# EAGLE design Audio interface (EAGLE 9.6.0)

## Sheet 1 of 2
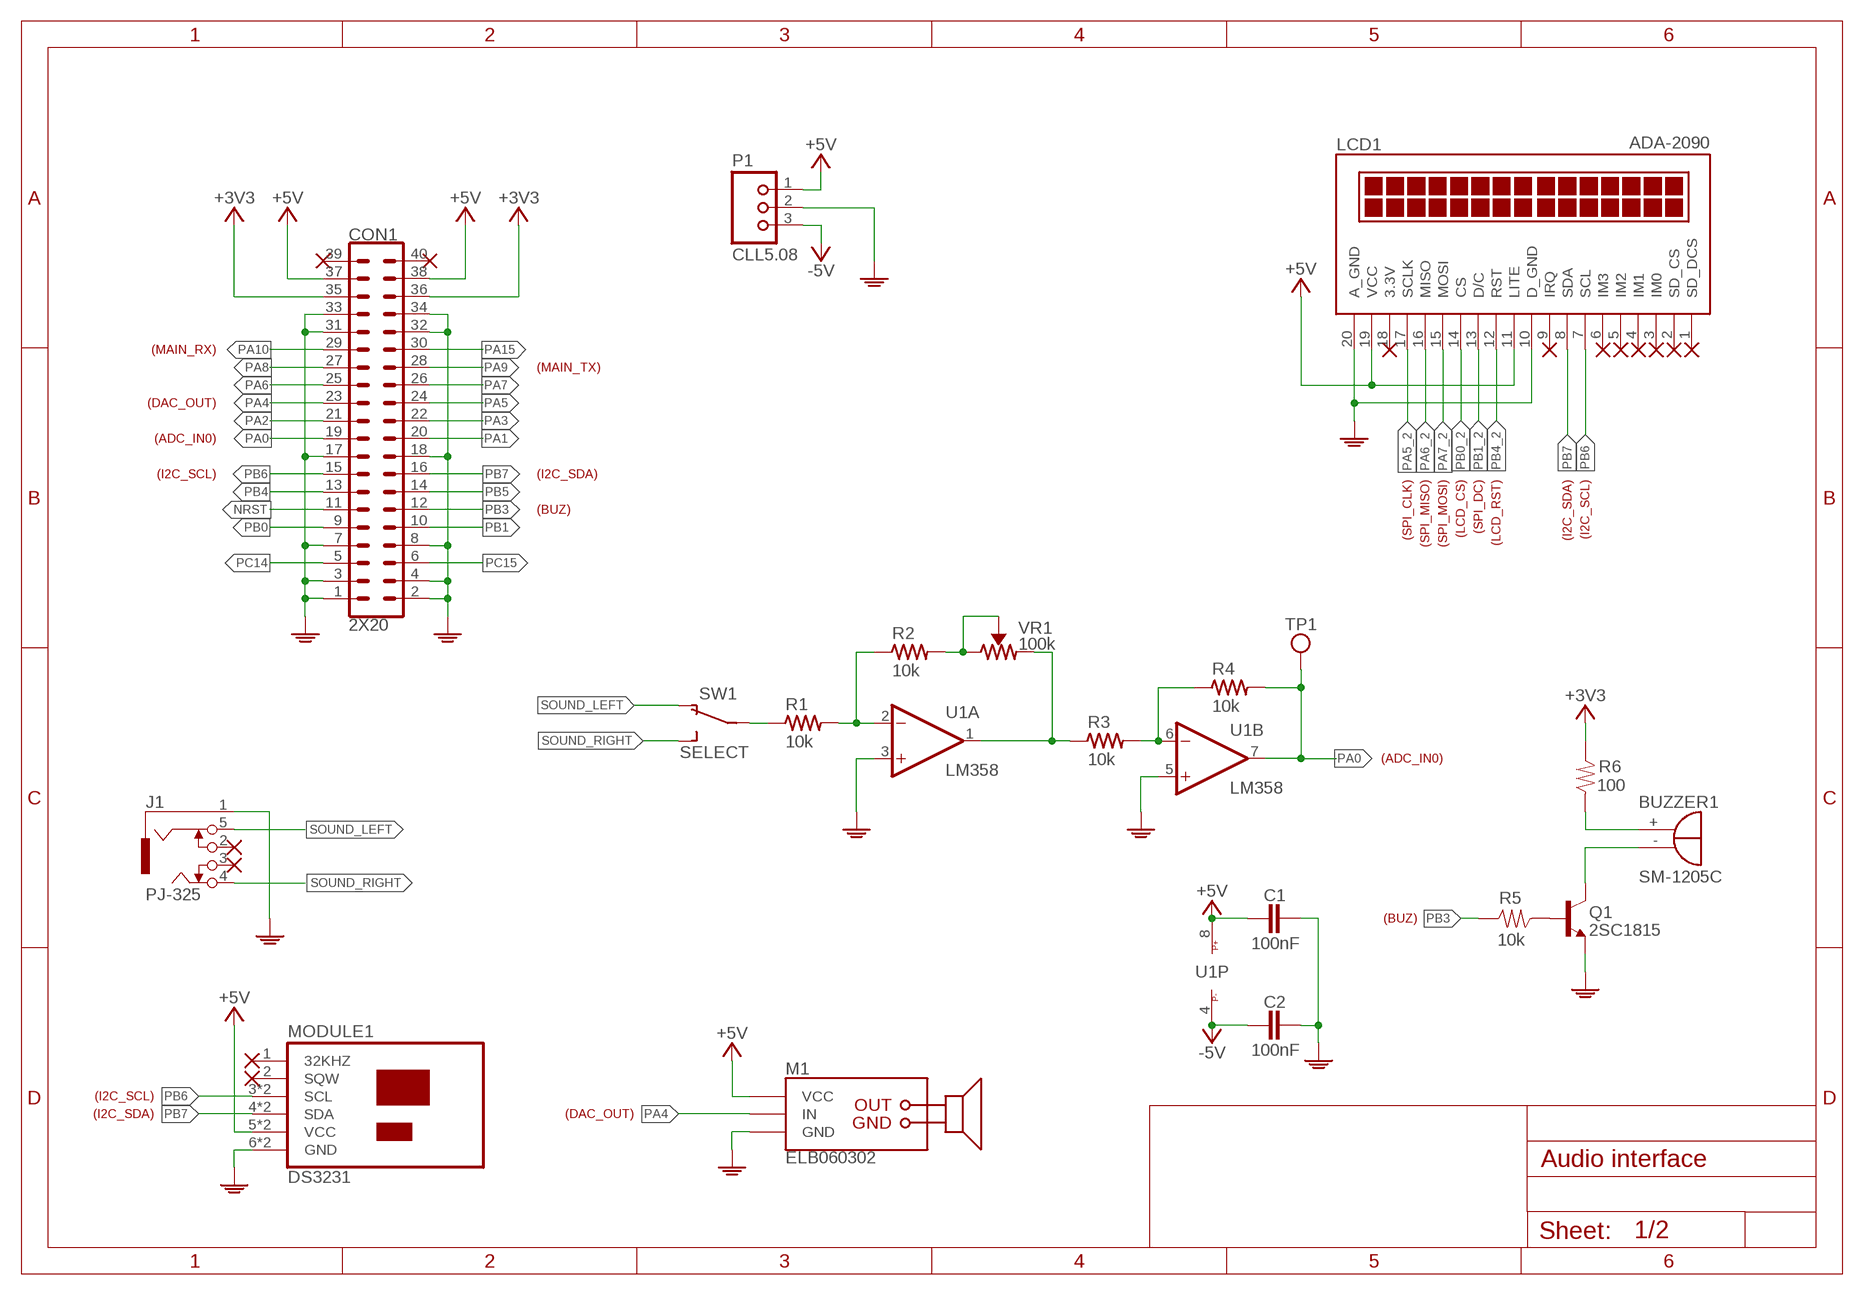
[diagram p0: schematic, sheet 1]

### Parts
BUZZER1  SM-1205C  BUZZER_(SM-1205C)  [SM-1205C]
C1  100nF  C-EUC2012  [C2012]
C2  100nF  C-EUC2012  [C2012]
CON1  2X20  HEADER_2X20_(VER_3DEFORMATION)  [2X20_VER3DEFORMATION]
J1  PJ-325  JACK(STEREO)_(PJ-325)  [PJ-325]
LCD1  ADA-2090  MODULE(ADA-1770)  [TOUCH_SCREEN]
M1  ELB060302  MODULE(ELB060302)  [MODULE(ELB060302)]
MODULE1  DS3231  MODULE(DS3231)  [MODULE(DS3231)]
P1  CLL5.08  TERMINAL(3P)_(CLL5.08)  [TERMINAL(CLL5.08-03P)]
Q1  2SC1815  TR_BJT(NPN)_(SOT23)  [SOT23]
R1  10k  RES_(2012)  [2012]
R2  10k  RES_(2012)  [2012]
R3  10k  RES_(2012)  [2012]
R4  10k  RES_(2012)  [2012]
R5  10k  RESSMD  [2012]
R6  100  RESSMD  [2012]
SW1  SELECT  SW(SPDT)_(MSL-1C2P)  [SW(MSL-1C2P)]
TP1  TP_(LC-2-G)  [TP(LC-2-G)]
U1  LM358  LM358_(SO)  [SO8(150MIL)]
VR1  100k  RES(VARIABLE)_(VZ067TL7)  [RTRIM(VZ067TL7)]

### Nets
+3V3 [power]: CON1.35 CON1.36 R6.2 ; also sheet 2
+5V [power]: C1.1 CON1.37 CON1.38 LCD1.11(LITE) LCD1.19(VCC) M1.2(VCC) MODULE1.5(VCC) MODULE1.9(VCC) P1.1 U1.8(P:P+)
-5V [power]: C2.1 P1.3 U1.4(P:P-)
GND [power]: C1.2 C2.2 CON1.1 CON1.2 CON1.3 CON1.4 CON1.7 CON1.8 CON1.17 CON1.18 CON1.31 CON1.32 CON1.33 CON1.34 J1.1(GND) LCD1.10(D_GND) LCD1.20(A_GND) M1.3(GND) MODULE1.6(GND) MODULE1.10(GND) P1.2 Q1.2(E) U1.3(A:+IN) U1.5(B:+IN) ; also sheet 2
N$4: BUZZER1.+ R6.1
N$5: BUZZER1.- Q1.3(C)
N$6: Q1.1(B) R5.1
N$10: R1.2 R2.1 U1.2(A:-IN)
N$11: R2.2 VR1.TAP(WIPER) VR1.TOP(CW)
N$12: R1.1 SW1.2(P)
N$13: R3.1 U1.1(A:OUT) VR1.BOT(CCW)
N$14: R3.2 R4.1 U1.6(B:-IN)
NRST: CON1.11 ; also sheet 2
PA0: CON1.19 R4.2 TP1.1 U1.7(B:OUT)
PA1: CON1.20
PA2: CON1.21
PA3: CON1.22
PA4: CON1.23 M1.1(IN)
PA5: CON1.24
PA5_2: LCD1.17(SCLK) ; also sheet 2
PA6: CON1.25
PA6_2: LCD1.16(MISO) ; also sheet 2
PA7: CON1.26
PA7_2: LCD1.15(MOSI) ; also sheet 2
PA8: CON1.27
PA9: CON1.28 ; also sheet 2
PA10: CON1.29 ; also sheet 2
PA15: CON1.30
PB0: CON1.9
PB0_2: LCD1.14(CS) ; also sheet 2
PB1: CON1.10
PB1_2: LCD1.13(D/C) ; also sheet 2
PB3: CON1.12 R5.2
PB4: CON1.13
PB4_2: LCD1.12(RST) ; also sheet 2
PB5: CON1.14
PB6: CON1.15 LCD1.7(SCL) MODULE1.3(SCL) MODULE1.7(SCL)
PB7: CON1.16 LCD1.8(SDA) MODULE1.4(SDA) MODULE1.8(SDA)
PC14: CON1.5
PC15: CON1.6
SOUND_LEFT: J1.5(SP1) SW1.1(O)
SOUND_RIGHT: J1.4(SP2) SW1.3(S)
Unconnected: CON1.39 CON1.40 J1.2(CP1) J1.3(CP2) LCD1.1(SD_DCS) LCD1.2(SD_CS) LCD1.3(IM0) LCD1.4(IM1) LCD1.5(IM2) LCD1.6(IM3) LCD1.9(IRQ) LCD1.18(3.3V) MODULE1.1(32KHZ) MODULE1.2(SQW)

### Notes on the sheet
- (MAIN_RX)
- (MAIN_TX)
- (DAC_OUT)
- (ADC_IN0)
- (I2C_SCL) | (I2C_SDA)
- (SPI_CLK) | (SPI_MISO) | (SPI_MOSI) | (LCD_CS) | (SPI_DC) | (LCD_RST) | (I2C_SDA) | (I2C_SCL)
- (BUZ)
- (ADC_IN0)
- (BUZ)
- (I2C_SCL)
- (I2C_SDA) | (DAC_OUT)

## Sheet 2 of 2
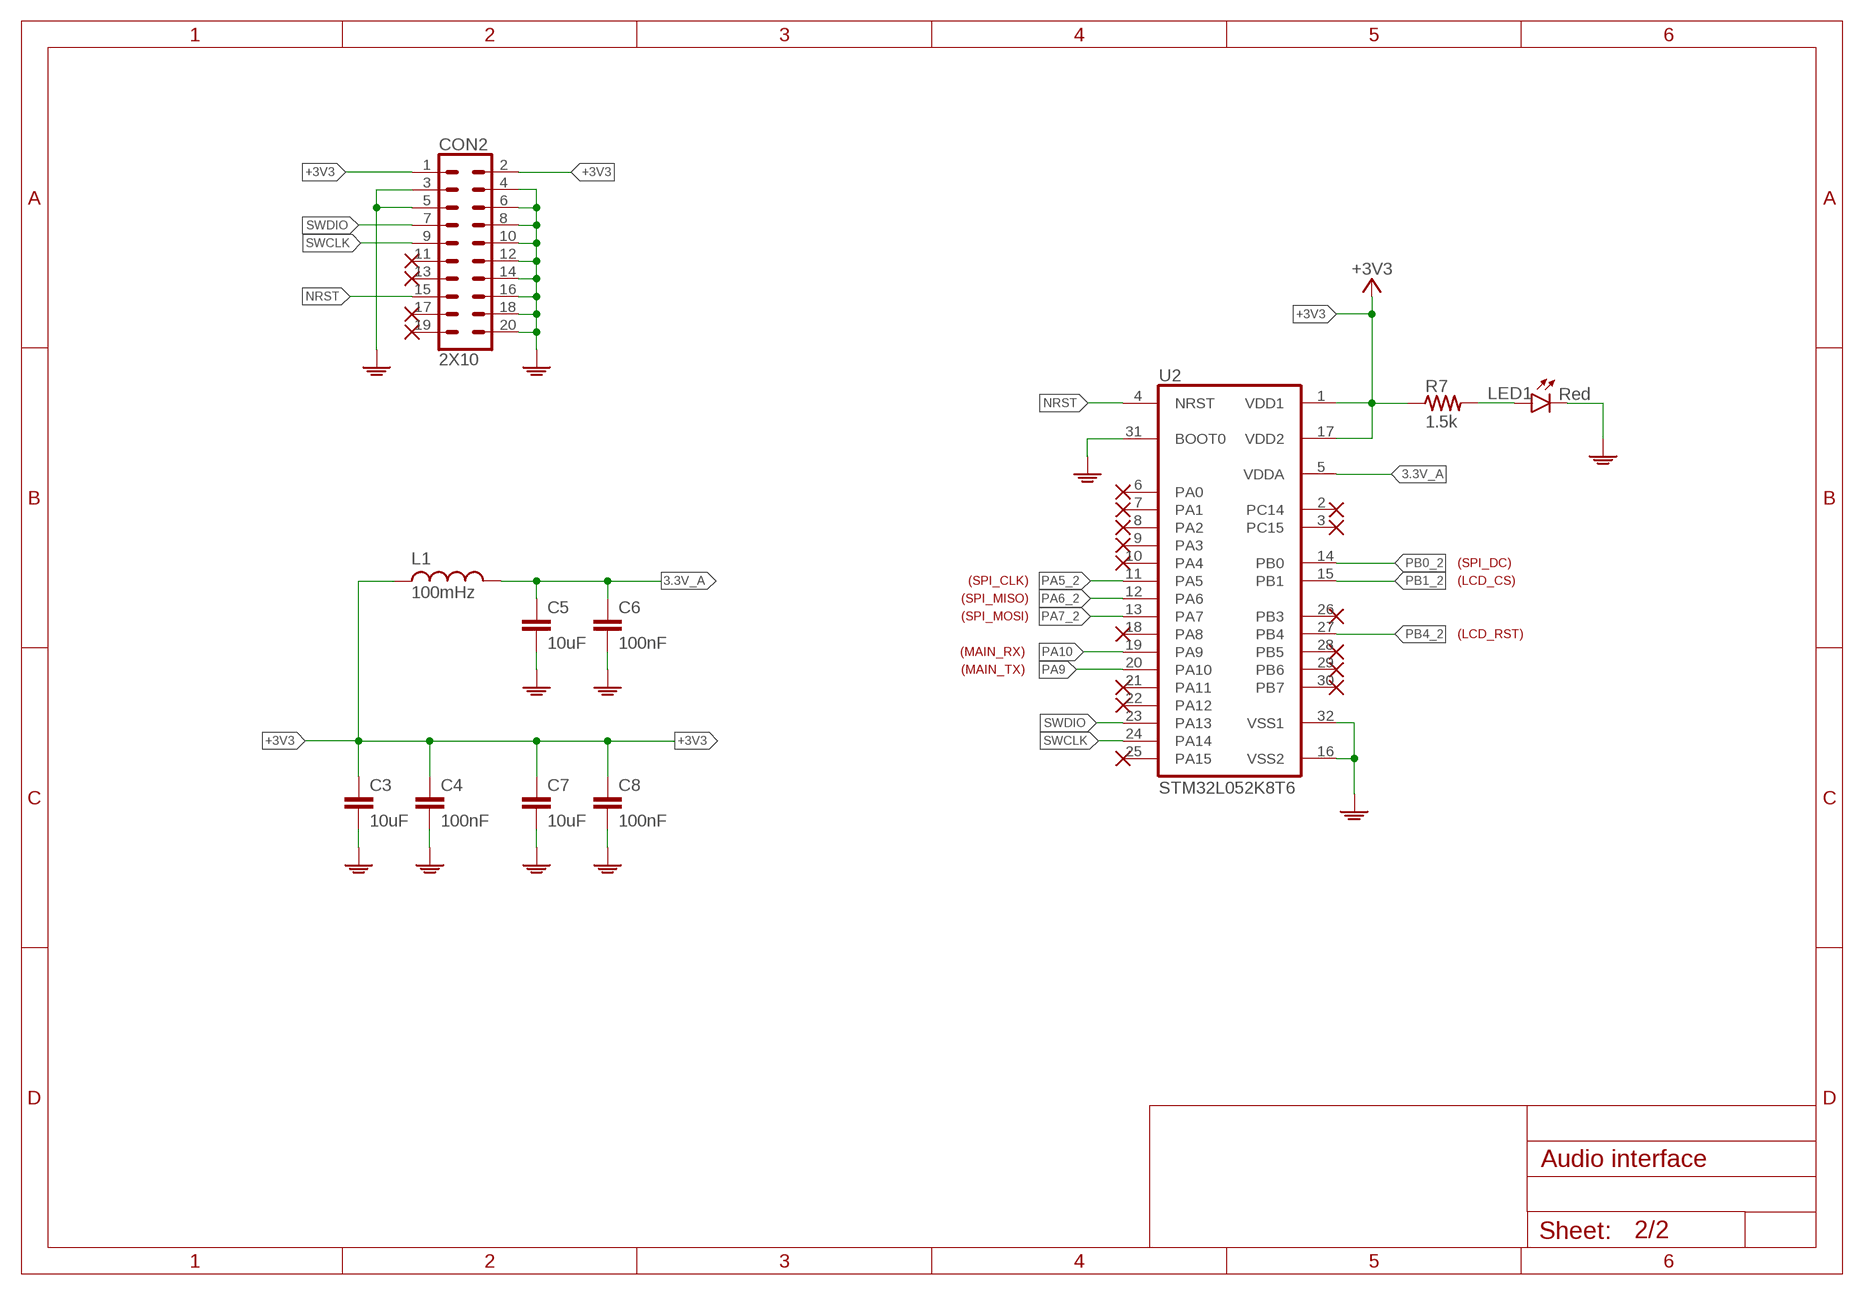
[diagram p1: schematic, sheet 2]

### Parts
C3  10uF  C-EUC0603K  [C0603K]
C4  100nF  C-EUC2012  [C2012]
C5  10uF  C-EUC0603K  [C0603K]
C6  100nF  C-EUC2012  [C2012]
C7  10uF  C-EUC0603K  [C0603K]
C8  100nF  C-EUC2012  [C2012]
CON2  2X10  HEADER_2X10_(PIN)  [2X10(MALE)]
L1  100mHz  L-US  [C0603K]
LED1  Red  LED(1-COLOR)_(0805)  [CHIP_0805(LED)]
R7  1.5k  RES_(2012)  [2012]
U2  STM32L052K8T6  STM32L052K6T6  [LQFP32]

### Nets
3.3V_A: C5.1 C6.1 L1.2 U2.5(VDDA)
+3V3 [power]: C3.1 C4.1 C7.1 C8.1 CON2.1 CON2.2 L1.1 R7.1 U2.1(VDD1) U2.17(VDD2) ; also sheet 1
GND [power]: C3.2 C4.2 C5.2 C6.2 C7.2 C8.2 CON2.3 CON2.4 CON2.5 CON2.6 CON2.8 CON2.10 CON2.12 CON2.14 CON2.16 CON2.18 CON2.20 LED1.1(C) U2.16(VSS2) U2.31(BOOT0) U2.32(VSS1) ; also sheet 1
N$9: LED1.2(A) R7.2
NRST: CON2.15 U2.4(NRST) ; also sheet 1
PA5_2: U2.11(PA5) ; also sheet 1
PA6_2: U2.12(PA6) ; also sheet 1
PA7_2: U2.13(PA7) ; also sheet 1
PA9: U2.20(PA10) ; also sheet 1
PA10: U2.19(PA9) ; also sheet 1
PB0_2: U2.14(PB0) ; also sheet 1
PB1_2: U2.15(PB1) ; also sheet 1
PB4_2: U2.27(PB4) ; also sheet 1
SWCLK: CON2.9 U2.24(PA14)
SWDIO: CON2.7 U2.23(PA13)
Unconnected: CON2.11 CON2.13 CON2.17 CON2.19 U2.2(PC14) U2.3(PC15) U2.6(PA0) U2.7(PA1) U2.8(PA2) U2.9(PA3) U2.10(PA4) U2.18(PA8) U2.21(PA11) U2.22(PA12) U2.25(PA15) U2.26(PB3) U2.28(PB5) U2.29(PB6) U2.30(PB7)

### Notes on the sheet
- (SPI_DC)
- (SPI_CLK) | (LCD_CS)
- (SPI_MISO)
- (SPI_MOSI)
- (LCD_RST)
- (MAIN_RX)
- (MAIN_TX)

## Library data of the parts
BUZZER1 = LIB_KMS:BUZZER: Buzzer
C1-C8 = rcl:C-EU: CAPACITOR, European symbol; SPICEPREFIX: C
CON1 = LIB_KMS:HEADER_2X20: Pin Header 2X20, 2.54mm pitch
CON2 = LIB_KMS:HEADER_2X10: Pin Header 2X10, 2.54mm pitch
J1 = LIB_KMS:JACK(STEREO): 3.5 Pie Phone Jack, Stereo Jack
L1 = rcl:L-US: INDUCTOR, American symbol
LCD1 = LIB_KMS:MODULE(ADA-1770)
LED1 = LIB_KMS:LED(1-COLOR): 1-Color LED
M1 = LIB_KMS:MODULE(ELB060302)
MODULE1 = LIB_KMS:MODULE(DS3231): RTC Module with I2C Interface, DS3231
P1 = LIB_KMS:TERMINAL(3P): 3-Pin Terminal Block
Q1 = LIB_KMS:TR_BJT(NPN): NPN Bipolar Junction Transistor
R1-R4 R7 = LIB_KMS:RES: Resistor
R5 R6 = for busan:RES
SW1 = LIB_KMS:SW(SPDT): Single Pole Dual Throw Switch
TP1 = LIB_KMS:TP: Test Point
U1 = LIB_KMS:LM358: Dual Operational Amplifier, Low Power
U2 = LIB_KMS:STM32L052K: Ultra Low Power 32-Bit MCU ARM
VR1 = LIB_KMS:RES(VARIABLE): Variable Resistor

## Net classes
1 power: width 0.5 mm

## Board
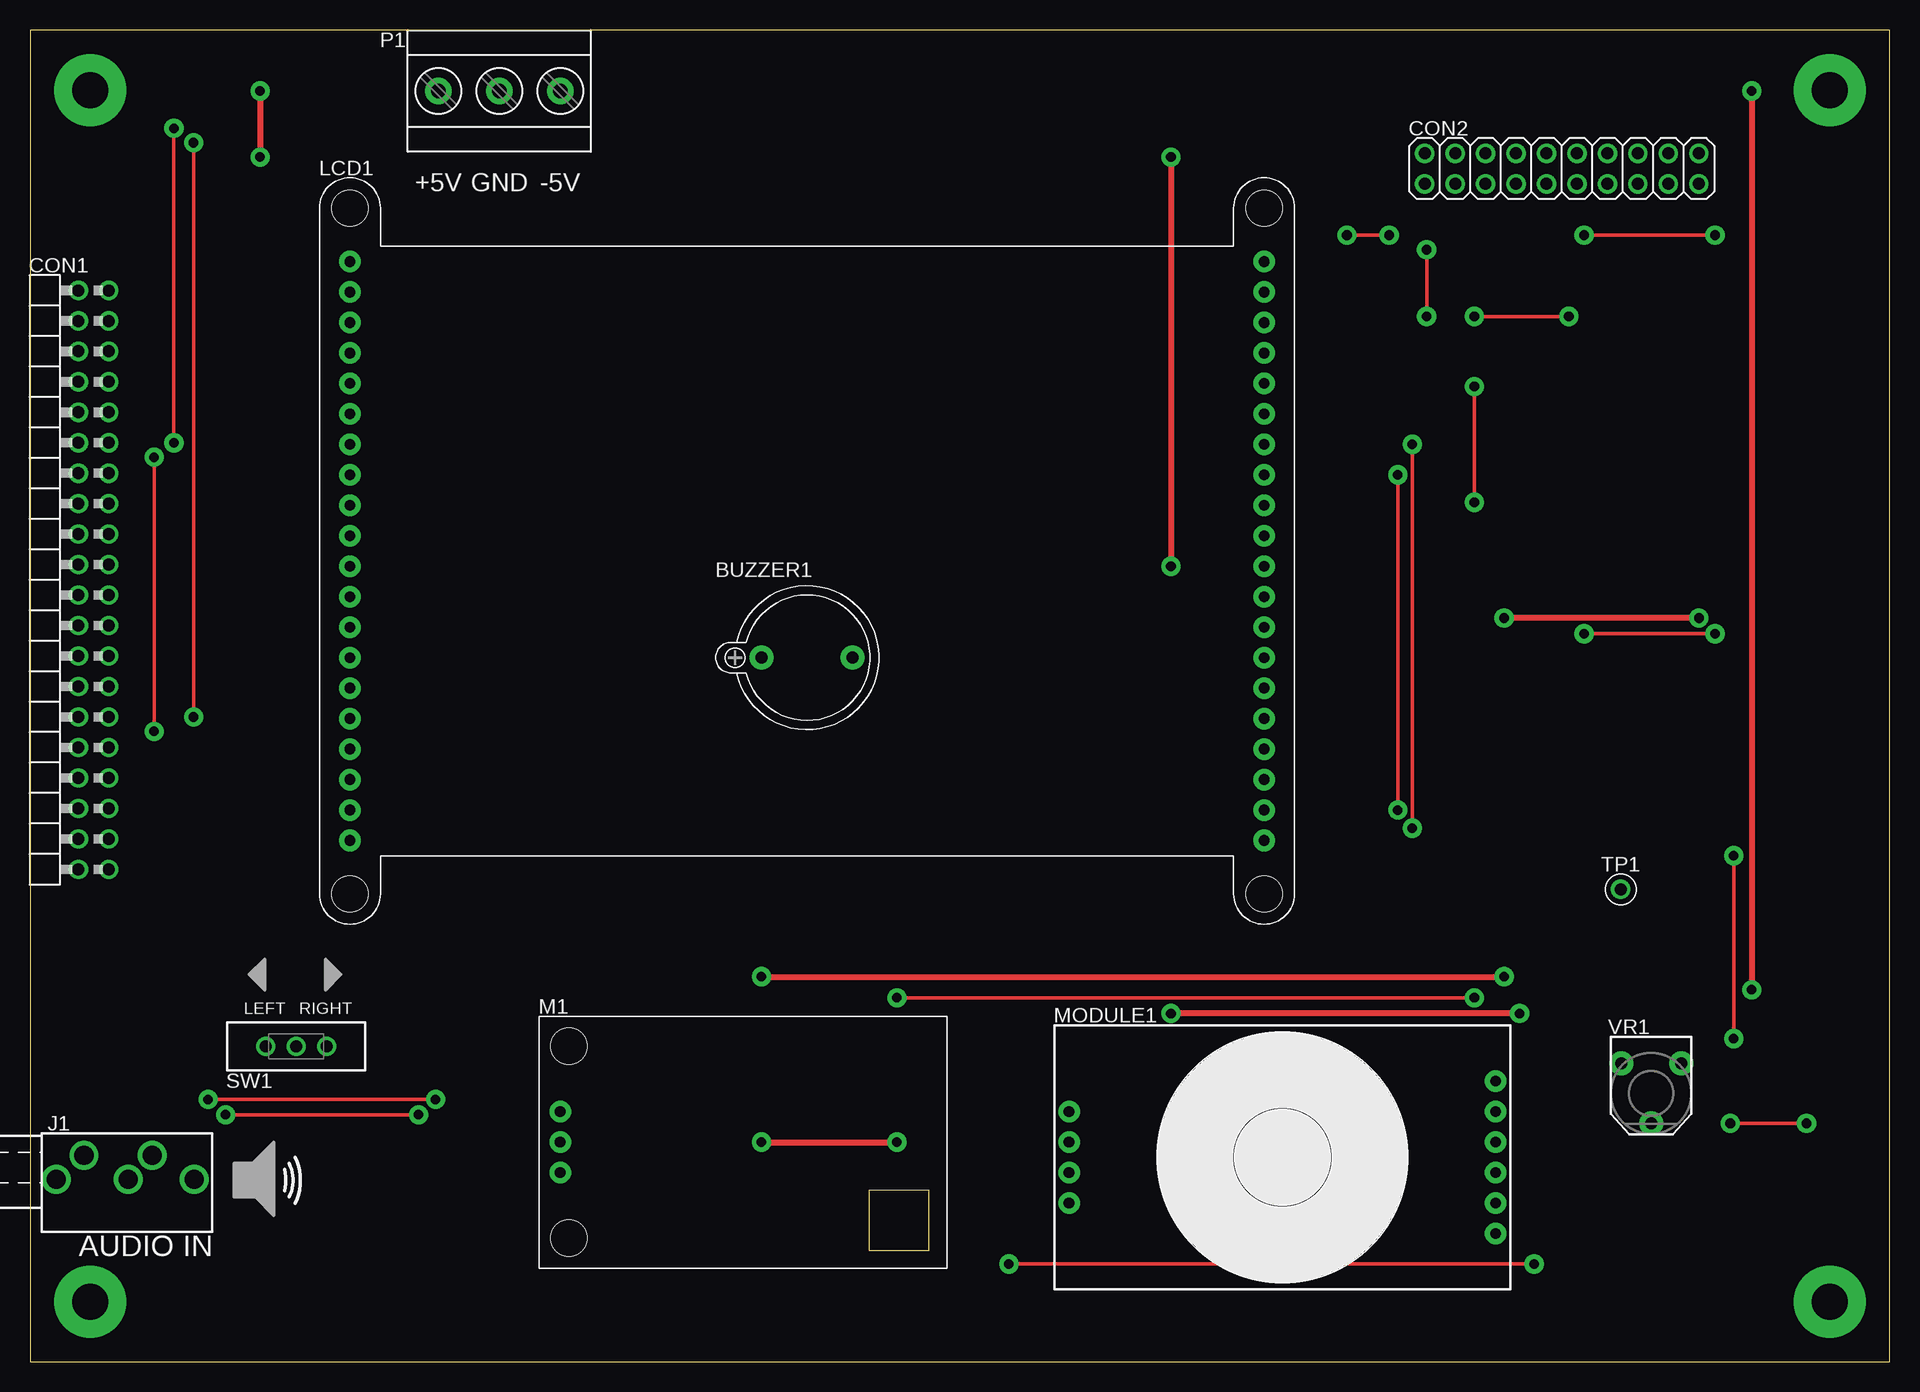
[diagram p2: board, top side]
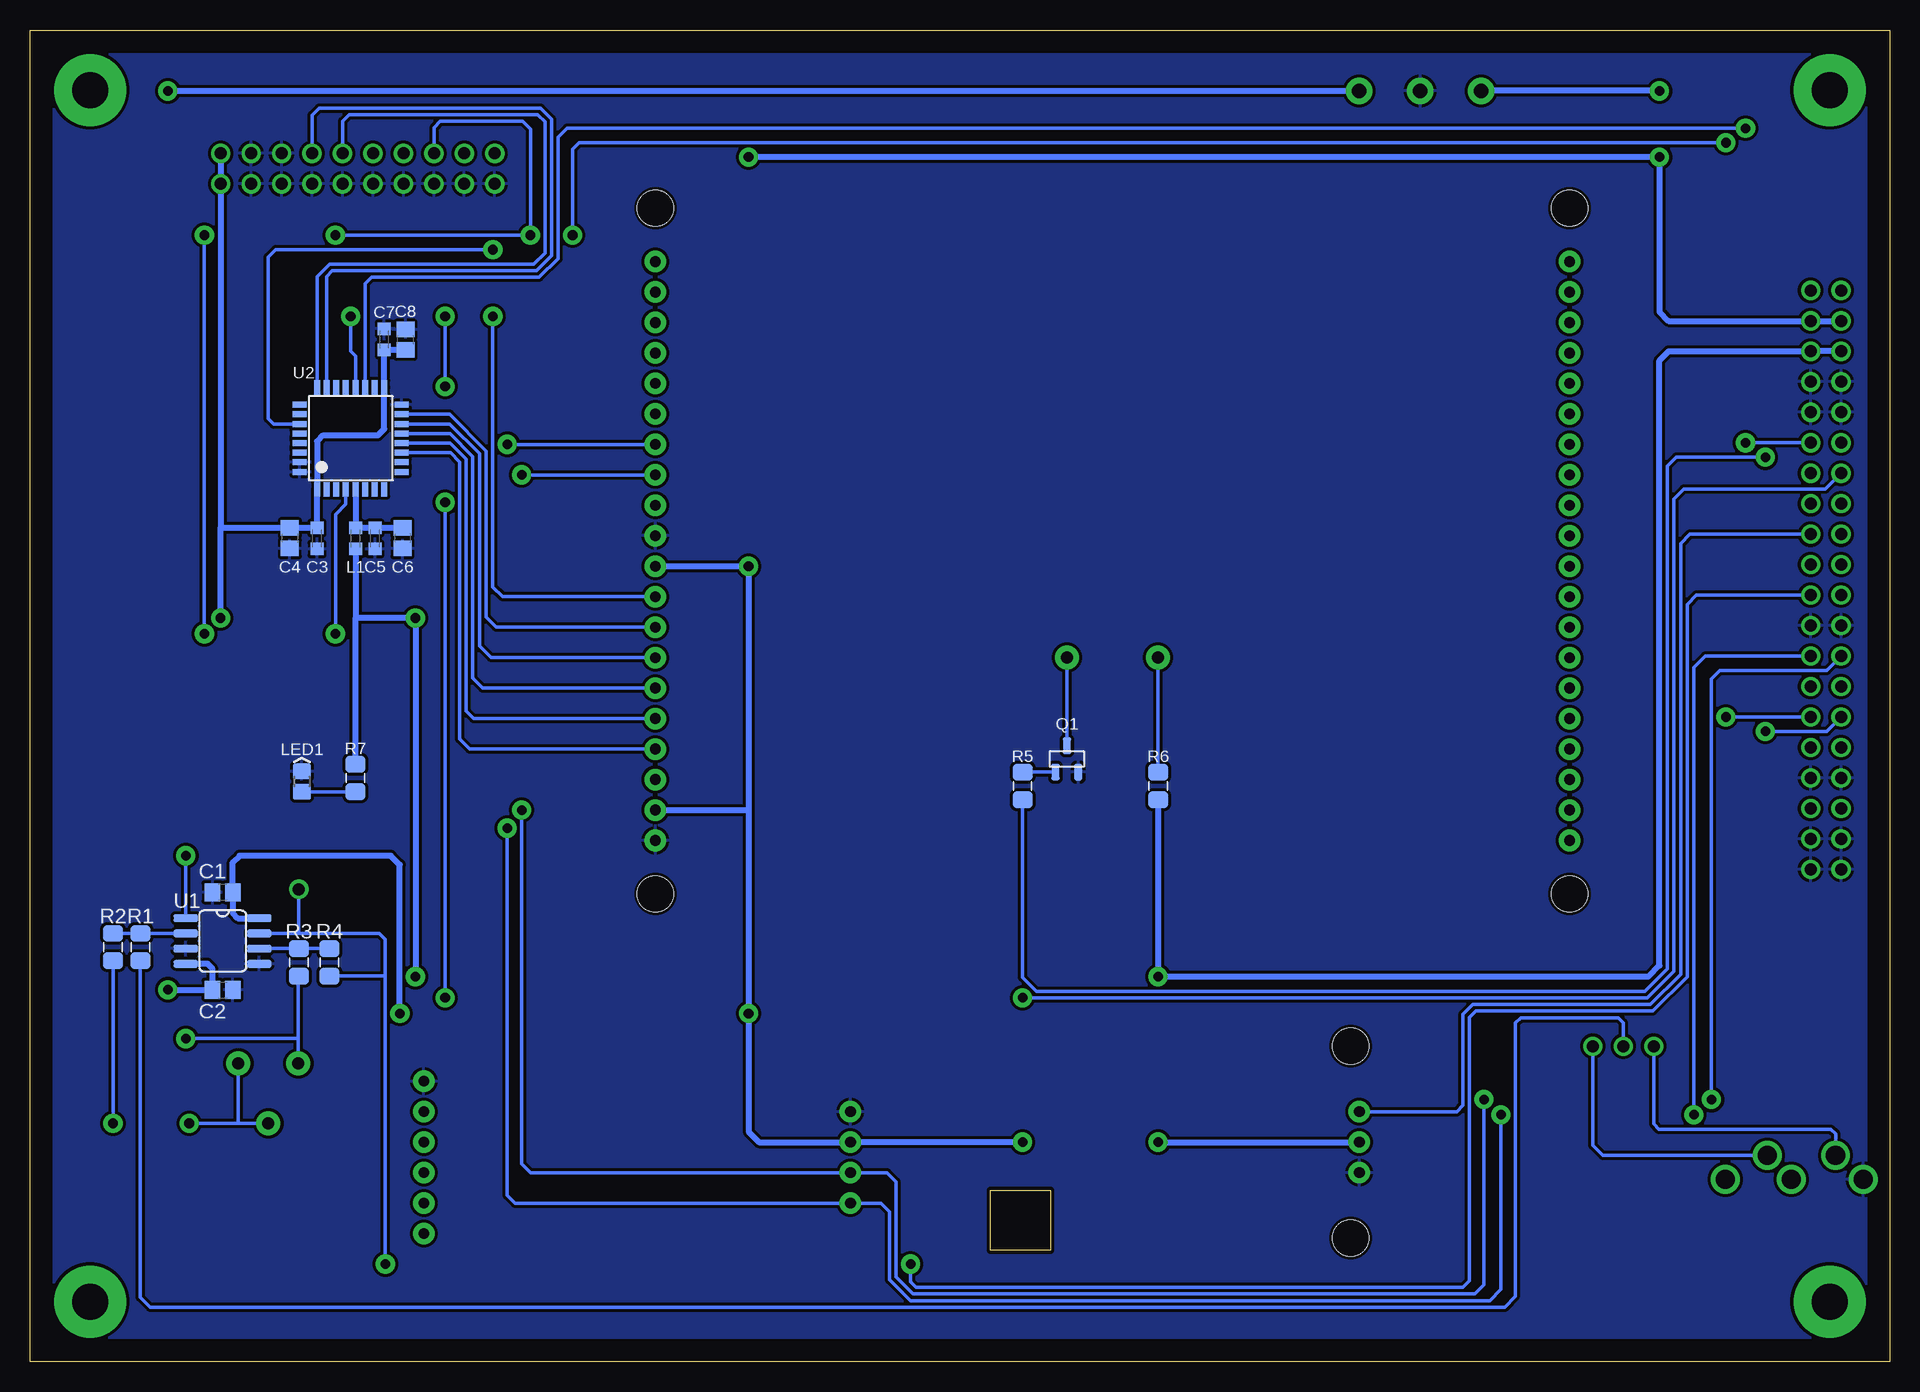
[diagram p3: board, bottom side, seen from below]

Size 155 x 111 mm. Coordinates in mm from the lower left corner, seen from the top.
Outline: 0,0 155,0 155,111 0,111 0,0
Copper layers (1*16): Top 0.035mm / dielectric 1.5mm / Bottom 0.035mm
Design rules "default *": minimum track width 0.3mm, minimum drill 0.8mm, track to track 10mil, track to pad 10mil, pad to pad 10mil, via to via 10mil, smd to smd 10mil, copper to edge 10mil, drill to drill 6mil, minimum pad ring 10mil, minimum via ring 8mil, stop-mask expansion 4mil, vias tented up to drill 0mil, thermal gap 10mil

### Footprints (pad centres in the part's own frame; a part is rotated, then mirrored left to right if it is on the bottom)
SM-1205C = drill 1 pad 2: + 0,3.8; - 0,-3.8
C2012 = smd 1.3 x 1.5: 1 -0.85,0; 2 0.85,0
C0603K = smd 1.05 x 1.08: 1 -0.875,0; 2 0.875,0
2X20_VER3DEFORMATION = drill 1 pad 1.6: 1 -24.13,-4.064; 2 -24.13,-1.524; 3 -21.59,-4.064; 4 -21.59,-1.524; 5 -19.05,-4.064; 6 -19.05,-1.524; 7 -16.51,-4.064; 8 -16.51,-1.524; 9 -13.97,-4.064; 10 -13.97,-1.524; 11 -11.43,-4.064; 12 -11.43,-1.524; 13 -8.89,-4.064; 14 -8.89,-1.524; 15 -6.35,-4.064; 16 -6.35,-1.524; 17 -3.81,-4.064; 18 -3.81,-1.524; 19 -1.27,-4.064; 20 -1.27,-1.524; 21 1.27,-4.064; 22 1.27,-1.524; 23 3.81,-4.064; 24 3.81,-1.524; 25 6.35,-4.064; 26 6.35,-1.524; 27 8.89,-4.064; 28 8.89,-1.524; 29 11.43,-4.064; 30 11.43,-1.524; 31 13.97,-4.064; 32 13.97,-1.524; 33 16.51,-4.064; 34 16.51,-1.524; 35 19.05,-4.064; 36 19.05,-1.524; 37 21.59,-4.064; 38 21.59,-1.524; 39 24.13,-4.064; 40 24.13,-1.524
2X10(MALE) = drill 1 pad 1.6: 1 -11.43,-1.27; 2 -11.43,1.27; 3 -8.89,-1.27; 4 -8.89,1.27; 5 -6.35,-1.27; 6 -6.35,1.27; 7 -3.81,-1.27; 8 -3.81,1.27; 9 -1.27,-1.27; 10 -1.27,1.27; 11 1.27,-1.27; 12 1.27,1.27; 13 3.81,-1.27; 14 3.81,1.27; 15 6.35,-1.27; 16 6.35,1.27; 17 8.89,-1.27; 18 8.89,1.27; 19 11.43,-1.27; 20 11.43,1.27
PJ-325 = drill 1.6 pad 2.4: 1 -3.9,-1; 2 2.1,-1; 3 7.6,-1; 4 -1.6,1; 5 4.1,1
TOUCH_SCREEN = drill 0.9 pad 1.8: 1 24.13,-38.1; 2 21.59,-38.1; 3 19.05,-38.1; 4 16.51,-38.1; 5 13.97,-38.1; 6 11.43,-38.1; 7 8.89,-38.1; 8 6.35,-38.1; 9 3.81,-38.1; 10 1.27,-38.1; 11 -1.27,-38.1; 12 -3.81,-38.1; 13 -6.35,-38.1; 14 -8.89,-38.1; 15 -11.43,-38.1; 16 -13.97,-38.1; 17 -16.51,-38.1; 18 -19.05,-38.1; 19 -21.59,-38.1; 20 -24.13,-38.1; 21 -24.13,38.1; 22 -21.59,38.1; 23 -19.05,38.1; 24 -16.51,38.1; 25 -13.97,38.1; 26 -11.43,38.1; 27 -8.89,38.1; 28 -6.35,38.1; 29 -3.81,38.1; 30 -1.27,38.1; 31 1.27,38.1; 32 3.81,38.1; 33 6.35,38.1; 34 8.89,38.1; 35 11.43,38.1; 36 13.97,38.1; 37 16.51,38.1; 38 19.05,38.1; 39 21.59,38.1; 40 24.13,38.1 | hole 3: -28.575,38.1; 28.575,38.1; -28.575,-38.1; 28.575,-38.1
CHIP_0805(LED) = smd 1.3 x 1.5: 1 -0.85,0; 2 0.85,0
MODULE(ELB060302) = drill 0.9 pad 1.8: 1 0,2.54; 2 0,0; 3 0,-2.54 | hole 3: 0.722,-8; 0.722,8
MODULE(DS3231) = drill 0.9 pad 1.8: 1 -6.35,0; 2 -3.81,0; 3 -1.27,0; 4 1.27,0; 5 3.81,0; 6 6.35,0; 7 -3.81,35.56; 8 -1.27,35.56; 9 1.27,35.56; 10 3.81,35.56
TERMINAL(CLL5.08-03P) = drill 1.2 pad 2.2: 1 -5.08,0; 2 0,0; 3 5.08,0
SOT23 = smd 0.7 x 1.4: 1 -0.95,-1.1; 2 0.95,-1.1; 3 0,1.1
2012 = smd 1.397 x 1.651: 1 0,0; 2 2.286,0
SW(MSL-1C2P) = drill 1 pad 1.6: 1 -2.54,0; 2 0,0; 3 2.54,0
TP(LC-2-G) = drill 1 pad 1.6: 1 0,0
SO8(150MIL) = smd 0.66 x 2.032: 1 -1.905,-3.073; 2 -0.635,-3.073; 3 0.635,-3.073; 4 1.905,-3.073; 5 1.905,3.048; 6 0.635,3.048; 7 -0.635,3.048; 8 -1.905,3.048
LQFP32 = smd 0.5 x 1.2: 1 -2.8,-4.25; 2 -2,-4.25; 3 -1.2,-4.25; 4 -0.4,-4.25; 5 0.4,-4.25; 6 1.2,-4.25; 7 2,-4.25; 8 2.8,-4.25; 17 2.8,4.25; 18 2,4.25; 19 1.2,4.25; 20 0.4,4.25; 21 -0.4,4.25; 22 -1.2,4.25; 23 -2,4.25; 24 -2.8,4.25 | smd 1.2 x 0.5: 9 4.25,-2.8; 10 4.25,-2; 11 4.25,-1.2; 12 4.25,-0.4; 13 4.25,0.4; 14 4.25,1.2; 15 4.25,2; 16 4.25,2.8; 25 -4.25,2.8; 26 -4.25,2; 27 -4.25,1.2; 28 -4.25,0.4; 29 -4.25,-0.4; 30 -4.25,-1.2; 31 -4.25,-2; 32 -4.25,-2.8
RTRIM(VZ067TL7) = drill 1 pad 2: BOT 2.5,-2.5; TAP 0,2.5; TOP -2.5,-2.5

### Placement (x,y rotation side)
BUZZER1  64.77,58.67 90 top
C1  138.94,39.12 180 bottom
C2  138.94,30.99 0 bottom
C3  131.07,68.61 270 bottom
C4  133.35,68.64 270 bottom
C5  126.24,68.61 270 bottom
C6  123.95,68.64 270 bottom
C7  125.48,85.21 90 bottom
C8  123.7,85.18 90 bottom
CON1  2.51,65.16 90 top
CON2  127.68,99.44 180 top
J1  6.1,16.18 0 top
L1  127.87,68.61 90 bottom
LCD1  64.77,67.56 90 top
LED1  132.33,48.35 270 bottom
M1  44.2,18.29 0 top
MODULE1  122.17,17.02 90 top
P1  39.12,105.92 0 top
Q1  68.57,50.23 0 bottom
R1  145.8,33.4 90 bottom
R2  148.08,35.69 270 bottom
R3  132.59,32.13 90 bottom
R4  130.05,34.42 270 bottom
R5  72.26,49.13 270 bottom
R6  60.97,49.13 270 bottom
R7  127.87,49.78 270 bottom
SW1  22.2,26.28 180 top
TP1  132.59,39.37 0 top
U1  138.94,35.05 270 bottom
U2  128.27,76.96 0 bottom
VR1  135.13,22.35 180 top

### Tracks (layer width: path | path; a pad name or v marks a point on that pad's centre or on a via)
3.3V_A
  Bottom 0.5: C6.1 C5.1 L1.2 U2.5
+3V3  (via drill 0.8 pad 1.6)
  Top 0.5: v60.97,32.08 v122.87,32.08 | v139.11,61.98 v122.87,61.98
  Bottom 0.5: CON1.36 CON1.35 18.41,84.21 19.18,83.44 19.18,33.02 20.12,32.08 v60.97,32.08 R6.2 | C8.1 C7.1 U2.17 125.47,77.73 125.98,77.22 130.56,77.22 131.07,76.7 U2.1 C3.1 C4.1 139.11,69.49 | CON2.1 CON2.2 139.11,69.49 | R7.1 127.87,61.98 | L1.1 127.87,61.98 | 127.87,61.98 v122.87,61.98 v122.87,32.08 | v139.11,61.98 139.11,69.49
+5V  (via drill 0.8 pad 1.6)
  Top 0.5: v124.17,29.01 v95.1,29.01 | v19.18,105.92 v19.18,100.4 | v60.97,18.29 v72.26,18.29 | v95.1,100.4 v95.1,66.29
  Bottom 0.5: v60.97,18.29 M1.2 | U1.8 137.67,36.96 138.09,37.38 C1.1 138.09,41.62 137.54,42.16 124.94,42.16 124.17,41.4 v124.17,29.01 | v19.18,105.92 P1.1 | v72.26,18.29 MODULE1.9 94.23,18.29 95.1,19.16 v95.1,29.01 95.1,45.97 | CON1.38 CON1.37 18.42,86.75 19.18,87.5 v19.18,100.4 v95.1,100.4 | LCD1.19 95.1,45.97 | LCD1.11 v95.1,66.29 95.1,45.97
-5V  (via drill 0.8 pad 1.6)
  Top 0.5: v143.51,105.92 v143.51,30.99
  Bottom 0.5: U1.4 140.21,33.15 139.79,32.73 C2.1 v143.51,30.99 | v143.51,105.92 P1.3
GND
  pour Bottom (isolate 0.254): 2,109 2,2 153,2 153,109
N$1  (via drill 3 pad 6)
  other vias: 5,5
N$2  (via drill 3 pad 6)
  other vias: 150,5
N$3  (via drill 3 pad 6)
  other vias: 150,106
N$4
  Bottom 0.3: R6.1 BUZZER1.+
N$5
  Bottom 0.3: Q1.3 BUZZER1.-
N$6
  Bottom 0.3: R5.1 Q1.1
N$7  (via drill 3 pad 6)
  other vias: 5,106
N$9
  Bottom 0.3: R7.2 LED1.2
N$10
  Bottom 0.3: U1.2 R1.2 R2.1
N$11  (via drill 0.8 pad 1.6)
  Top 0.3: v141.73,19.85 v148.08,19.85
  Bottom 0.3: VR1.TOP 137.63,19.85 | v148.08,19.85 R2.2 | VR1.TAP 137.63,19.85 | 137.63,19.85 v141.73,19.85
N$12
  Bottom 0.3: R1.1 145.8,5.33 144.99,4.53 32.08,4.53 31.18,5.42 31.18,28.21 30.73,28.66 22.61,28.66 22.2,28.25 SW1.2
N$13  (via drill 0.8 pad 1.6)
  Top 0.3: v142.01,42.16 v142.01,26.92
  Bottom 0.3: VR1.BOT 132.63,26.92 | 132.63,26.92 132.63,32.09 R3.1 | U1.1 v142.01,42.16 | v142.01,26.92 132.63,26.92
N$14
  Bottom 0.3: R4.1 R3.2 U1.6
NRST  (via drill 0.8 pad 1.6)
  Top 0.3: v13.64,53.73 v13.64,101.6 | v140.46,93.89 v129.54,93.89 | v129.54,60.67 v140.46,60.67 | v113.28,93.89 v109.77,93.89
  Bottom 0.3: CON2.15 121.33,102.87 120.82,103.38 113.92,103.38 113.28,102.74 v113.28,93.89 v129.54,93.89 | U2.4 128.67,71.48 129.54,70.61 v129.54,60.67 | CON1.11 v13.64,53.73 | v140.46,60.67 v140.46,93.89 | v109.77,93.89 109.77,101.05 109.22,101.6 v13.64,101.6
PA0  (via drill 0.8 pad 1.6)
  Top 0.3: v125.38,8.13 v81.6,8.13
  Bottom 0.3: CON1.19 16.09,63.89 16.86,63.12 16.86,32.06 19.71,29.21 34.5,29.21 35.01,28.7 35.01,6.74 35.56,6.19 81.15,6.19 81.6,6.63 v81.6,8.13 | 125.38,32.13 125.38,35.18 125.89,35.69 132.59,35.69 | R4.2 125.38,32.13 | U1.7 132.59,35.69 | TP1.1 132.59,35.69 | v125.38,8.13 125.38,32.13
PA4
  Bottom 0.3: M1.1 36.07,20.83 35.56,21.34 35.56,28.93 34.73,29.76 19.94,29.76 17.41,32.29 17.41,68.2 16.64,68.97 CON1.23
PA5_2
  Bottom 0.3: LCD1.17 118.36,51.05 119.19,51.88 119.19,75 119.96,75.76 U2.11
PA6_2
  Bottom 0.3: LCD1.16 118,53.59 118.64,54.23 118.64,75.22 119.97,76.56 U2.12
PA7_2
  Bottom 0.3: LCD1.15 117.26,56.13 118.08,56.96 118.08,75.45 119.99,77.36 U2.13
PA9  (via drill 0.8 pad 1.6)
  Top 0.3: v72.26,30.32 v120.4,30.32 | v120.4,71.63 v120.4,81.28 | v120.4,87.12 v128.27,87.12
  Bottom 0.3: CON1.28 5.37,72.71 17.14,72.71 17.97,71.89 17.97,32.52 20.17,30.32 v72.26,30.32 | v120.4,30.32 v120.4,71.63 | v120.4,81.28 v120.4,87.12 | U2.20 127.87,83.82 128.27,84.22 v128.27,87.12
PA10  (via drill 0.8 pad 1.6)
  Top 0.3: v11.99,76.59 v11.99,102.81
  Bottom 0.3: CON1.29 v11.99,76.59 | U2.19 127.07,89.85 126.54,90.38 112.55,90.38 110.97,91.95 110.97,102.07 110.24,102.81 v11.99,102.81
PB0_2
  Bottom 0.3: LCD1.14 116.58,58.67 117.53,59.63 117.53,75.68 120.01,78.16 U2.14
PB1_2
  Bottom 0.3: LCD1.13 116.15,61.21 116.98,62.04 116.98,75.91 120.02,78.96 U2.15
PB3  (via drill 0.8 pad 1.6)
  Top 0.3: v10.35,52.53 v10.35,75.39
  Bottom 0.3: v10.35,52.53 5.24,52.53 CON1.12 | v10.35,75.39 17.78,75.39 18.52,74.64 18.52,32.75 20.4,30.87 71.11,30.87 72.26,32.02 72.26,45.97 R5.2
PB4_2  (via drill 0.8 pad 1.6)
  Top 0.3: v116.42,87.12 v116.42,92.69
  Bottom 0.3: LCD1.12 115.59,63.75 116.42,64.58 v116.42,87.12 | v116.42,92.69 134.51,92.69 135.13,92.08 135.13,78.61 134.68,78.16 U2.27
PB6  (via drill 0.8 pad 1.6)
  Top 0.3: v32.38,20.57 v16.31,20.57 | v115.22,76.45 v115.22,44.45
  Bottom 0.3: CON1.15 15.37,58.81 16.31,57.87 v16.31,20.57 | v115.22,44.45 115.22,13.87 114.55,13.21 MODULE1.7 84.07,13.21 83.36,12.49 83.36,6.83 81.61,5.08 33.32,5.08 32.38,6.02 v32.38,20.57 | v115.22,76.45 LCD1.7
PB7  (via drill 0.8 pad 1.6)
  Top 0.3: v14.84,21.84 v33.8,21.84 | v114.01,73.91 v114.01,45.97
  Bottom 0.3: CON1.16 5.24,57.61 14.13,57.61 14.84,56.9 v14.84,21.84 | v33.8,21.84 33.8,6.4 34.57,5.63 81.38,5.63 82.8,7.06 82.8,14.99 83.57,15.75 MODULE1.8 113.28,15.75 114.01,16.48 v114.01,45.97 | LCD1.8 v114.01,73.91
SOUND_LEFT
  Bottom 0.3: SW1.1 24.74,18.03 23.88,17.18 J1.5
SOUND_RIGHT
  Bottom 0.3: SW1.3 19.66,19.81 19.21,19.37 4.89,19.37 4.5,18.97 J1.4
SWCLK
  Bottom 0.3: CON2.9 128.95,103.38 128.4,103.93 112.67,103.93 112.08,103.34 112.08,92.41 113,91.49 116.59,91.49 130.02,91.49 131.07,90.44 U2.24
SWDIO
  Bottom 0.3: U2.23 130.27,90.46 129.79,90.93 112.78,90.93 111.53,92.18 111.53,103.57 112.44,104.49 130.91,104.49 131.49,103.91 CON2.7

### Text on the board
tPlace: +5V | GND | -5V | LEFT | RIGHT | AUDIO IN